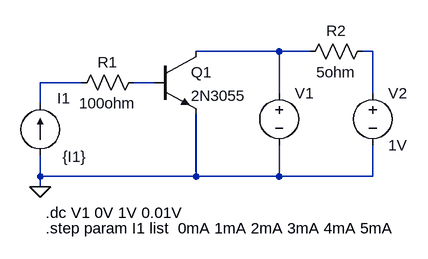
[diagram p0: schematic Transistor.asc]
Transistor.asc, the LTspice schematic file:
Version 4
SHEET 1 880 680
WIRE 336 80 208 80
WIRE 384 80 336 80
WIRE 480 80 464 80
WIRE 32 128 -32 128
WIRE 144 128 112 128
WIRE 336 144 336 80
WIRE 480 144 480 80
WIRE -32 160 -32 128
WIRE -32 272 -32 240
WIRE 208 272 208 176
WIRE 208 272 -32 272
WIRE 336 272 336 224
WIRE 336 272 208 272
WIRE 480 272 480 224
WIRE 480 272 336 272
WIRE -32 288 -32 272
FLAG -32 288 0
SYMBOL res 16 144 R270
WINDOW 0 32 56 VTop 2
WINDOW 3 0 56 VBottom 2
SYMATTR InstName R1
SYMATTR Value 100ohm
SYMBOL voltage 336 128 R0
WINDOW 123 0 0 Left 0
WINDOW 39 0 0 Left 0
SYMATTR InstName V1
SYMATTR Value ""
SYMBOL npn 144 80 R0
SYMATTR InstName Q1
SYMATTR Value 2N3055
SYMBOL res 480 64 R90
WINDOW 0 0 56 VBottom 2
WINDOW 3 32 56 VTop 2
SYMATTR InstName R2
SYMATTR Value 5ohm
SYMBOL voltage 480 128 R0
SYMATTR InstName V2
SYMATTR Value 1V
SYMBOL current -32 240 R180
WINDOW 0 -46 88 Left 2
WINDOW 3 -71 -2 Left 2
SYMATTR InstName I1
SYMATTR Value {I1}
TEXT -24 328 Left 2 !.dc V1 0V 1V 0.01V
TEXT -24 352 Left 2 !.step param I1 list  0mA 1mA 2mA 3mA 4mA 5mA

The netlist it stands for:
* Transistor.asc
R1 N003 N004 100ohm
V1 N001 0
Q1 N001 N004 0 0 2N3055
R2 N002 N001 5ohm
V2 N002 0 1V
I1 0 N003 {I1}
.model NPN NPN
.model PNP PNP
.lib standard.bjt
.dc V1 0V 1V 0.01V
.step param I1 list  0mA 1mA 2mA 3mA 4mA 5mA
.backanno
.end